# Altium schematic sheet Hambmark_PCB-practice-STM32-two-wheel-balancing-car__PRJ__1_Power.SchDoc
size A3; SheetNumber: 2; SheetTotal: 2
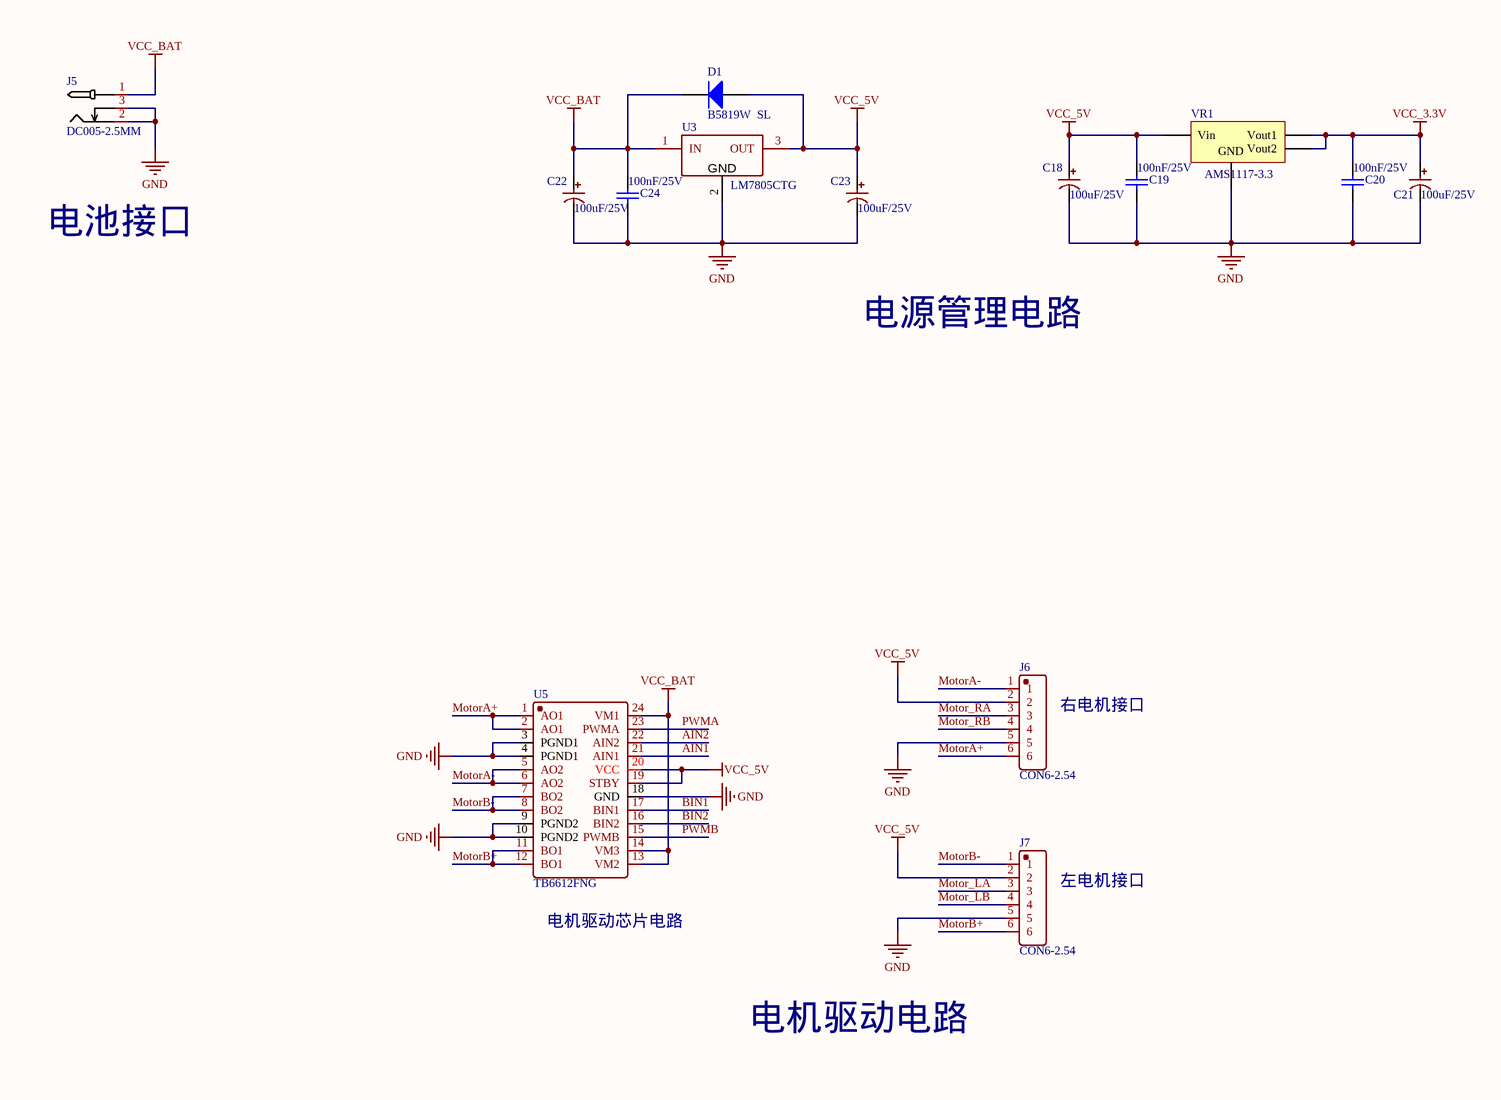
[diagram p0: Hambmark_PCB-practice-STM32-two-wheel-balancing-car__PRJ__1_Power.SchDoc]

## Parts
C18  100uF/25V  [C0603]
C19  100nF/25V  [C0603]
C20  100nF/25V  [C0603]
C21  100uF/25V  [C0603]
C22  100uF/25V  [C0603]
C23  100uF/25V  [C0603]
C24  100nF/25V  [C0603]
D1  B5819W  SL  [SOD-123]
J5  DC005-2.5MM  [DC-IN-TH_DC005]
J6  CON6-2.54  [HDR-TH_6P-P2.54-V-M]
J7  CON6-2.54  [HDR-TH_6P-P2.54-V-M]
U3  LM7805CTG  [TO-220-3_L10.2-W4.5-P2.54-L]
U5  TB6612FNG  [SSOP-24_L8.4-W5.8-P0.65-LS7.8-BL]
VR1  AMS1117-3.3  [SOT-223]

## Nets
GND: C18.2 C19.1 C20.1 C21.2 C22.2 C23.2 C24.1 J5.2 J5.3 J6.5 J7.5 U3.2(GND) U5.3(PGND1) U5.4(PGND1) U5.9(PGND2) U5.10(PGND2) U5.18(GND) VR1.1(GND)
VCC_3.3V: C20.2 C21.1 VR1.2(Vout1) VR1.4(Vout2)
VCC_5V: C18.1 C19.2 C23.1 D1.1(A) J6.2 J7.2 U3.3(OUT) U5.19(STBY) U5.20(VCC) VR1.3(Vin)
VCC_BAT: C22.1 C24.2 D1.2(K) J5.1 U3.1(IN) U5.13(VM2) U5.14(VM3) U5.24(VM1)
AIN1: U5.21(AIN1)
AIN2: U5.22(AIN2)
BIN1: U5.17(BIN1)
BIN2: U5.16(BIN2)
Motor_LA: J7.3
Motor_LB: J7.4
Motor_RA: J6.3
Motor_RB: J6.4
MotorA+: J6.6 U5.1(AO1) U5.2(AO1)
MotorA-: J6.1 U5.5(AO2) U5.6(AO2)
MotorB+: J7.6 U5.11(BO1) U5.12(BO1)
MotorB-: J7.1 U5.7(BO2) U5.8(BO2)
PWMA: U5.23(PWMA)
PWMB: U5.15(PWMB)

## Notes on the sheet
- 电池接口
- 电源管理电路
- (near J6) 右电机接口
- (near J7) 左电机接口
- (near U5) 电机驱动芯片电路
- 电机驱动电路

## Library data of the parts
C19 C20 C24 = 0805 100nF(104) 10% 50V: 贴片电容; ComponentLink1Description: 供应商链接; ComponentLink1URL: http://www.szlcsc.com/product/details_50686.html; Package: 0805; Supplier: LC; SuppliersPartNumber: C49678
D1 = SOD-123 B5819W  SL: 肖特基二极管; ComponentLink1Description: 供应商链接; ComponentLink1URL: http://www.szlcsc.com/product/details_9093.html; Package: SOD-123; Supplier: LC; SuppliersPartNumber: C8598
VR1 = SOT-223 AMS1117-3.3: 低压差线性稳压(LDO); ComponentLink1Description: 供应商链接; ComponentLink1URL: http://www.szlcsc.com/product/details_6652.html; Package: SOT-223; Supplier: LC; SuppliersPartNumber: C6186